# Altium schematic sheet Sheet1.SchDoc
size A4
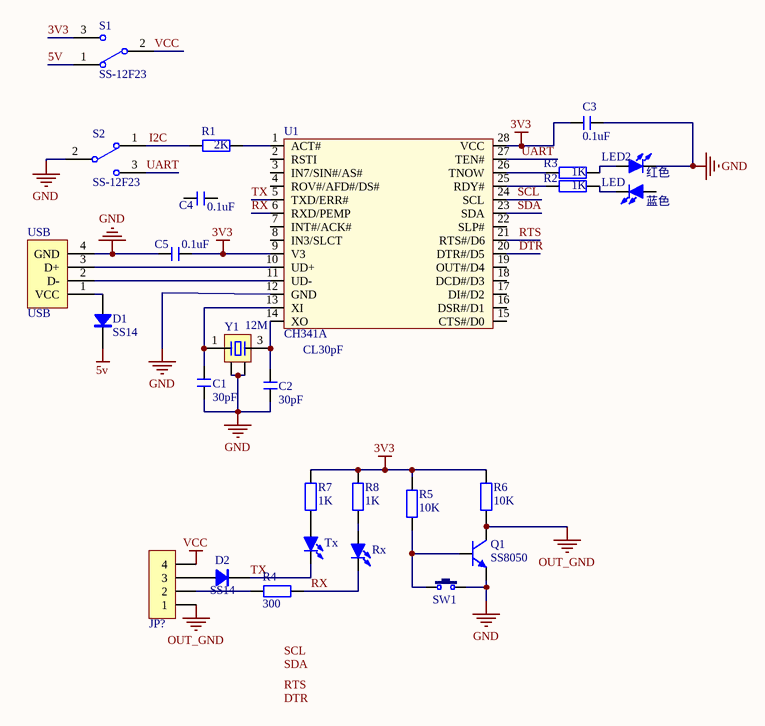
[diagram p0: Sheet1.SchDoc]

## Parts
C1  30pF  [C 0603_L]
C2  30pF  [C 0603_L]
C3  0.1uF  [C 0603_L]
C4  0.1uF  [C 0603_L]
C5  0.1uF  [C 0603_L]
D1  SS14  [SOD-323]
D2  SS14  [SOD-323]
JP?  HDR-1X4  [2.54_WSPIN_4PIN]  (value not drawn)
LED  蓝色  [LED 0603B]
LED2  红色  [LED 0603R]
LED3  Tx  [LED 0603B]
LED4  Rx  [LED 0603B]
Q1  SS8050  [SOT23-3L]
R1  2K  [R 0603_L]
R2  1K  [R 0603_L]
R3  1K  [R 0603_L]
R4  300  [R 0603_L]
R5  10K  [R 0603_L]
R6  10K  [R 0603_L]
R7  1K  [R 0603_L]
R8  1K  [R 0603_L]
S1  SS-12F23  [SK-12D07VG3]
S2  SS-12F23  [SK-12D07VG3]
SW1  3x6x5  [SW_1]  (value not drawn)
U1  CH341A  [SOP28_L]
USB  USB  [USB_A/P_A]
Y1  12M  负载电容: CL30pF  [OSC 3225-4P]

## Nets
3V3: C3.1 C5.2 R5.2 R6.2 R7.2 R8.2 S1.3 U1.9(V3) U1.28(VCC)
5V: D1.2(K) S1.1
GND: C1.1 C2.1 C3.2 C5.1 LED2.2(K) Q1.2(E) S2.2 SW1.2 U1.12(GND) USB.4(GND) Y1.2 Y1.4
OUT_GND: JP?.1 Q1.3(C) R6.1
VCC: JP?.4 S1.2
DTR: U1.20(DTR#/D5)
I2C: R1.1 S2.1
RTS: U1.21(RTS#/D6)
RX: LED4.2(K) R4.2 U1.6(RXD/PEMP)
SCL: U1.24(SCL)
SDA: U1.23(SDA)
TX: D2.2(K) LED3.2(K) U1.5(TXD/ERR#)
UART: S2.3 U1.27(TEN#)
NetC1_2: C1.2 U1.13(XI) Y1.1
NetC2_2: C2.2 U1.14(XO) Y1.3
NetD1_1: D1.1(A) USB.1(VCC)
NetD2_1: D2.1(A) JP?.3
NetJP?_2: JP?.2 R4.1
NetLED2_1: LED2.1(A) R3.2
NetLED3_1: LED3.1(A) R7.1
NetLED4_1: LED4.1(A) R8.1
NetLED_2: LED.2(K) R2.2
NetQ1_1: Q1.1(B) R5.1 SW1.1
NetR1_2: R1.2 U1.1(ACT#)
NetR2_1: R2.1 U1.25(RDY#)
NetR3_1: R3.1 U1.26(TNOW)
NetU1_10: U1.10(UD+) USB.3(D+)
NetU1_11: U1.11(UD-) USB.2(D-)

Not connected (* = marked no-connect by the designer): C4 1 2; LED 1(A); U1 2(RSTI) 3(IN7/SIN#/AS#) 4(ROV#/AFD#/DS#) 7(INT#/ACK#) 8(IN3/SLCT) 15(CTS#/D0) 16(DSR#/D1) 17(DI#/D2) 18(DCD#/D3) 19(OUT#/D4) 22(SLP#)

## Notes on the sheet
- Labels drawn without touching a wire or pin: DTR, RTS, SCL, SDA

## Library data of the parts
C1-C5 = C: 无极性贴片电容; 材质: X7R; BOM名称: 无极性贴片电容
D1 D2 = SS14: 肖特基二极管; 版权归属: 源创客; 属性: 40V/1A; BOM名称: 肖特基二极管; 学习资源: www.ooocke.com
JP? = Header 4: 4P接插件; 版权归属: 源创客; BOM名称: 4P接插件; 学习资源: www.ooocke.com
LED LED2-LED4 = LED-SMD: 贴片LED; 版权归属: 源创客; BOM名称: 贴片LED; 学习资源: www.ooocke.com
Q1 = 8050-SMD: 高频放大-NPN型; 版权归属: 源创客; 属性: 40V 1.5A 1W 100MHZ; BOM名称: 高频放大-NPN型; 学习资源: www.ooocke.com
R1-R8 = R: 贴片电阻; 版权归属: 源创客; BOM名称: 贴片电阻; 学习资源: www.ooocke.com
S1 S2 = SSW-1P: 1路波动开关; BOM名称: 波动开关; 版权归属: 源创客; 学习资源: www.ooocke.com
SW1 = TSW 3x6: 3x6轻触开关; 版权归属: 源创客; BOM名称: 3x6轻触开关; 学习资源: www.ooocke.com
U1 = CH341A_SOP28
USB = USB-A/P: USB-A型公接口; 版权归属: 源创客; BOM名称: USB-A型公接口; 学习资源: www.ooocke.com
Y1 = XTAL-4P: 4脚无源晶振; 版权归属: 源创客; BOM名称: 4脚无源晶振; 学习资源: www.ooocke.com